# EAGLE design BarGraphDriver (EAGLE 7.5.0)
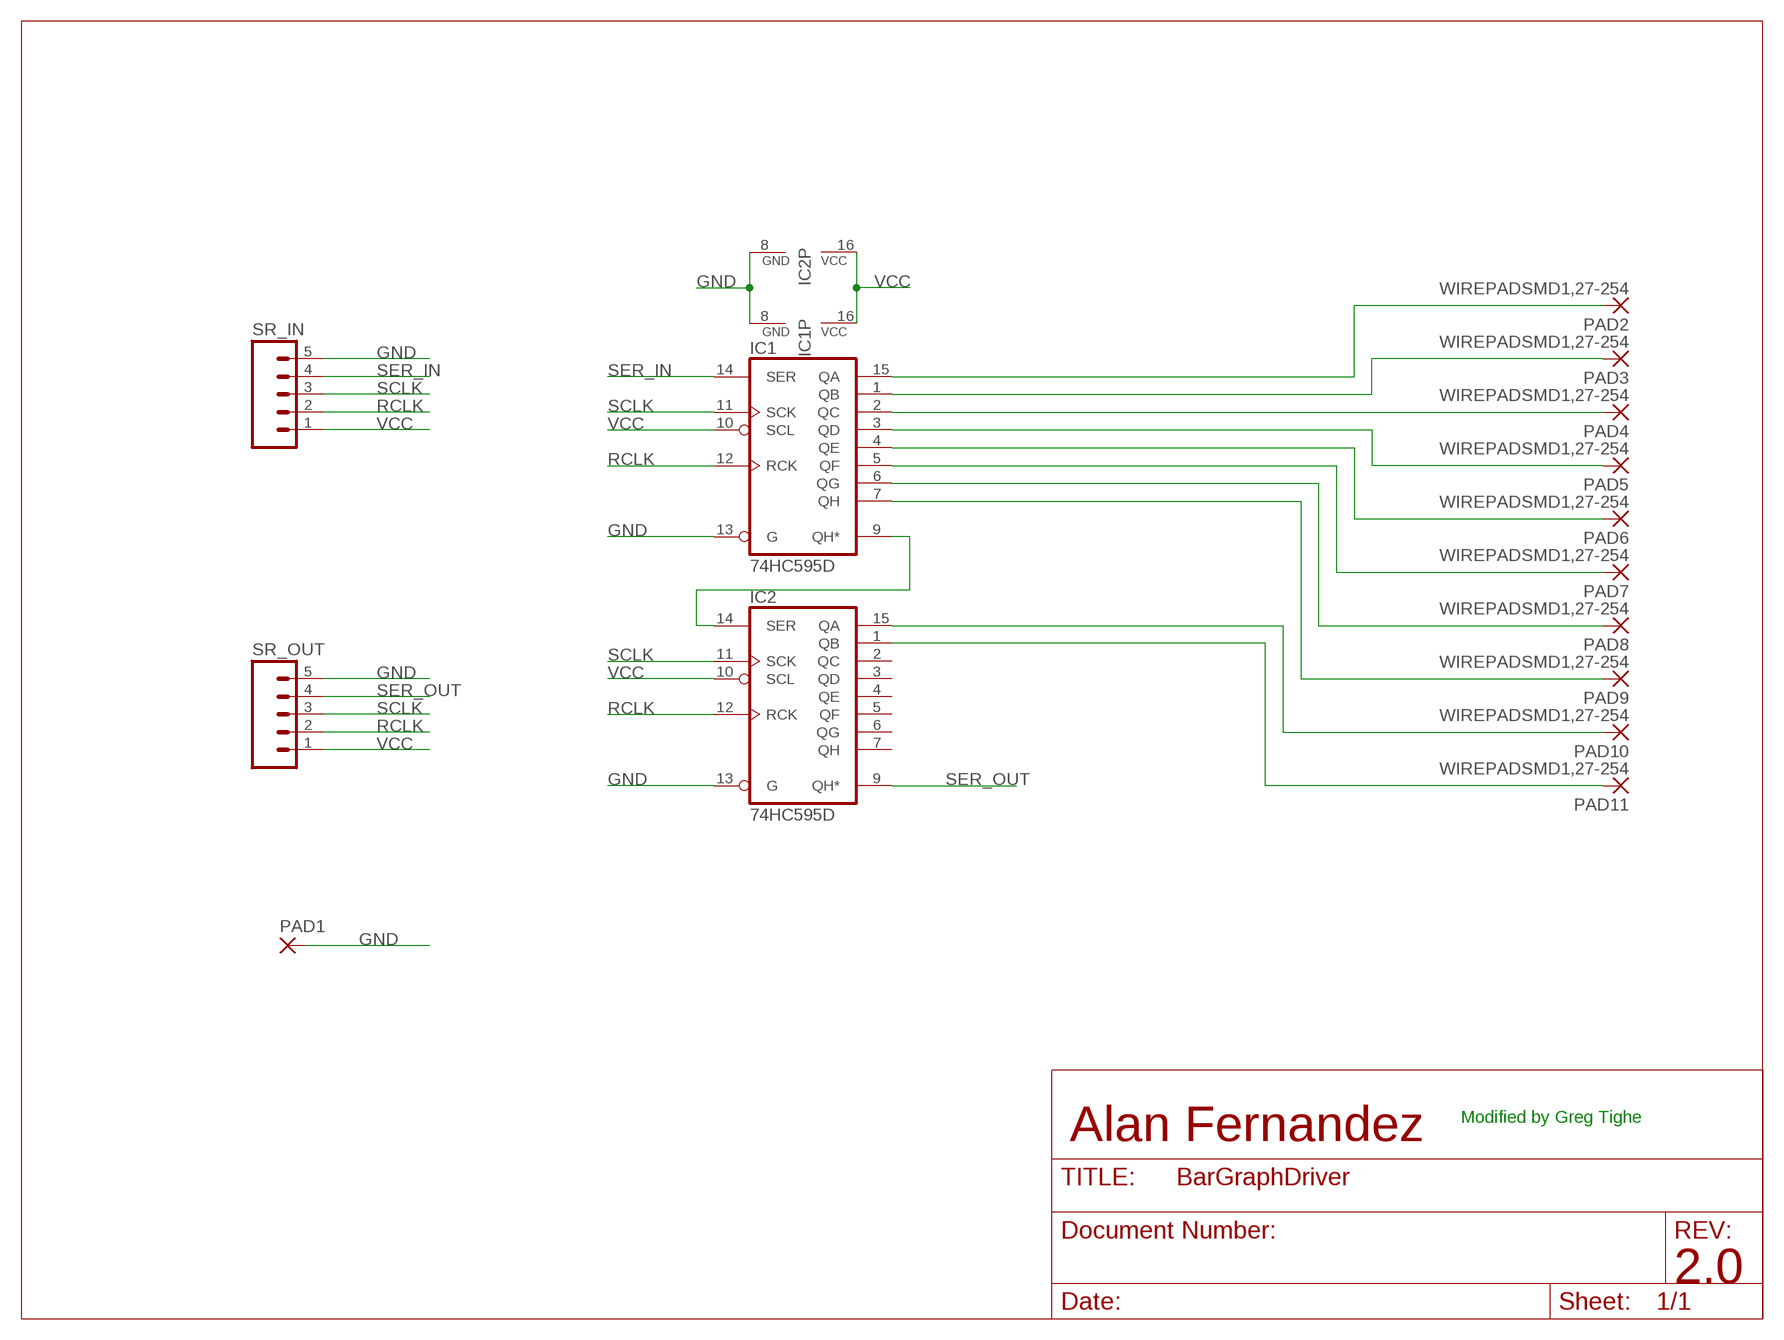
[diagram p0: schematic, sheet 1]

## Parts
IC1  74HC595D  [SO16]
IC2  74HC595D  [SO16]
PAD1  SMD2  [SMD1,27-2,54]
PAD2  WIREPADSMD1,27-254  [SMD1,27-2,54]
PAD3  WIREPADSMD1,27-254  [SMD1,27-2,54]
PAD4  WIREPADSMD1,27-254  [SMD1,27-2,54]
PAD5  WIREPADSMD1,27-254  [SMD1,27-2,54]
PAD6  WIREPADSMD1,27-254  [SMD1,27-2,54]
PAD7  WIREPADSMD1,27-254  [SMD1,27-2,54]
PAD8  WIREPADSMD1,27-254  [SMD1,27-2,54]
PAD9  WIREPADSMD1,27-254  [SMD1,27-2,54]
PAD10  WIREPADSMD1,27-254  [SMD1,27-2,54]
PAD11  WIREPADSMD1,27-254  [SMD1,27-2,54]
SR_IN  M05PTH  [1X05]
SR_OUT  M05PTH  [1X05]

## Nets
GND [GND]: IC1.8(GND) IC1.13(G) IC2.8(GND) IC2.13(G) PAD1.1(P) SR_IN.5 SR_OUT.5
N$1 [LED]: IC2.1(QB) PAD11.1(P)
N$11 [LED]: IC1.15(QA) PAD2.1(P)
N$12 [LED]: IC1.1(QB) PAD3.1(P)
N$13 [LED]: IC1.2(QC) PAD4.1(P)
N$14 [LED]: IC1.3(QD) PAD5.1(P)
N$15 [LED]: IC1.4(QE) PAD6.1(P)
N$16 [LED]: IC1.5(QF) PAD7.1(P)
N$17 [LED]: IC1.6(QG) PAD8.1(P)
N$18 [LED]: IC1.7(QH) PAD9.1(P)
N$19 [LED]: IC2.15(QA) PAD10.1(P)
N$22: IC1.9(QH*) IC2.14(SER)
RCLK: IC1.12(RCK) IC2.12(RCK) SR_IN.2 SR_OUT.2
SCLK: IC1.11(SCK) IC2.11(SCK) SR_IN.3 SR_OUT.3
SER_IN: IC1.14(SER) SR_IN.4
SER_OUT: IC2.9(QH*) SR_OUT.4
VCC [VCC]: IC1.10(SCL) IC1.16(VCC) IC2.10(SCL) IC2.16(VCC) SR_IN.1 SR_OUT.1
Unconnected: IC2.2(QC) IC2.3(QD) IC2.4(QE) IC2.5(QF) IC2.6(QG) IC2.7(QH)

## Notes on the sheet
- Modified by Greg Tighe
- Alan Fernandez
- 2.0

## Library data of the parts
IC1 IC2 = 74xx-eu:74*595: 8-bit SHIFT REGISTER, output latch
PAD1 = wirepad:SMD2: SMD PAD
PAD2-PAD11 = wirepad:WIREPAD: Wire PAD connect wire on PCB
SR_IN SR_OUT = SparkFun-Connectors:M05: Header 5 Standard 5-pin 0.1" header. Use with straight break away headers (SKU : PRT-00116), right angle break away headers (PRT-00553), swiss pins (PRT-00743), machine pins (PRT-00117), and female headers (PRT-00115). Molex polarized connector foot print use with SKU : PRT-08230 with associated crimp pins and housings.

## Net classes
0 default: width 0.406 mm, drill 0.381 mm, clearance 0.305 mm
1 VCC: width 0.406 mm, drill 0.381 mm, clearance 0.305 mm
2 LED: width 0.406 mm, drill 0.381 mm, clearance 0.305 mm
3 GND: width 0.406 mm, drill 0.381 mm, clearance 0.305 mm

## Board
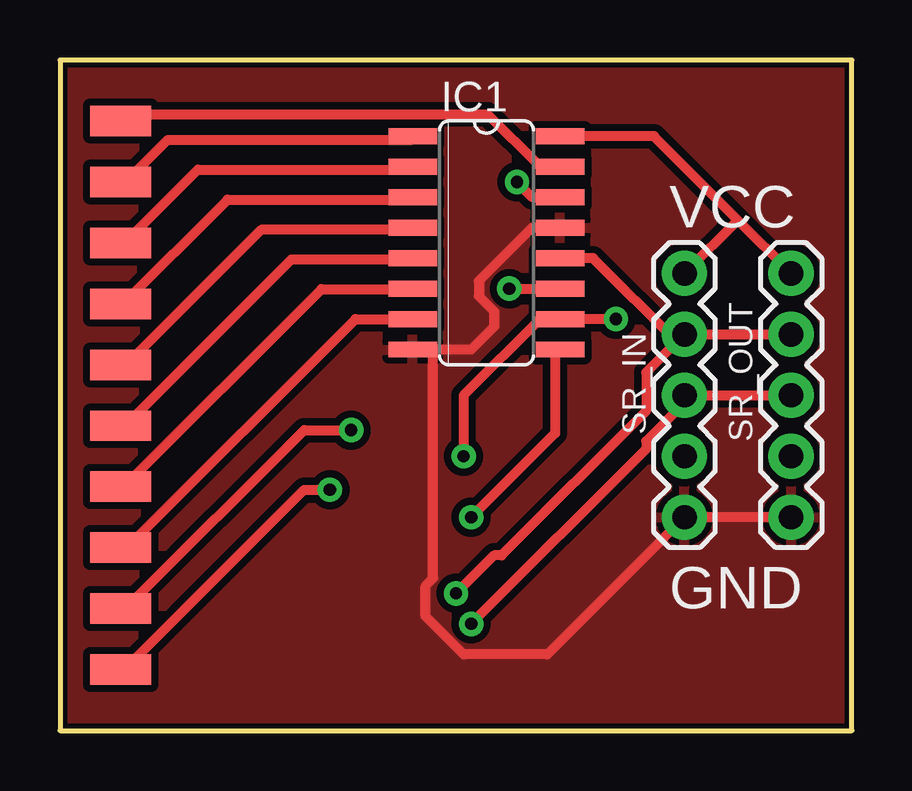
[diagram p1: board, top side]
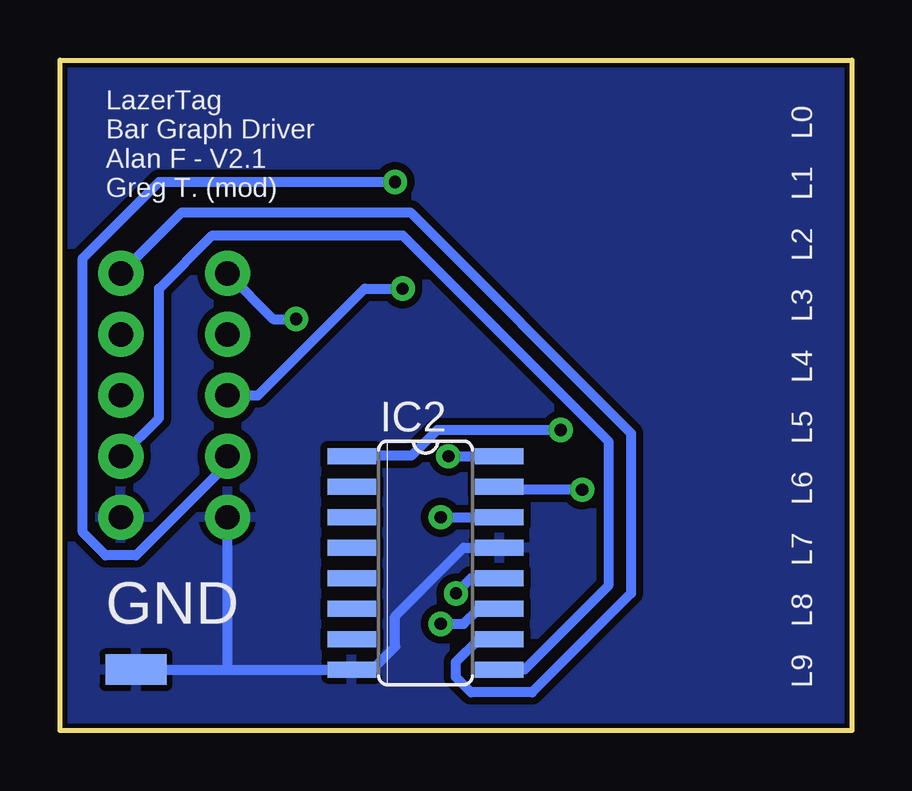
[diagram p2: board, bottom side, seen from below]

Size 33.02 x 27.94 mm. Coordinates in mm from the lower left corner, seen from the top.
Outline: 0,27.94 0,0 33.02,0 33.02,27.94 0,27.94
Copper layers (1*16): Top 0.035mm / dielectric 1.5mm / Bottom 0.035mm
Design rules "SparkFun-2-layer-STANDARD": minimum track width 10mil, minimum drill 20mil, track to track 10mil, track to pad 8mil, pad to pad 8mil, via to via 10mil, smd to smd 8mil, copper to edge 8mil, drill to drill 8mil, minimum pad ring 10mil, minimum via ring 10mil, stop-mask expansion 4mil, vias tented up to drill 25mil, thermal gap 10mil

### Footprints (pad centres in the part's own frame; a part is rotated, then mirrored left to right if it is on the bottom)
SO16 = smd 0.66 x 2.032: 1 -4.445,-3.073; 2 -3.175,-3.073; 3 -1.905,-3.073; 4 -0.635,-3.073; 5 0.635,-3.073; 6 1.905,-3.073; 7 3.175,-3.073; 8 4.445,-3.073; 9 4.445,3.073; 10 3.175,3.073; 11 1.905,3.073; 12 0.635,3.073; 13 -0.635,3.073; 14 -1.905,3.073; 15 -3.175,3.073; 16 -4.445,3.073
SMD1,27-2,54 = smd 1.27 x 2.54: 1 0,0
1X05 = drill 1.016 pad 1.88: 1 0,0; 2 2.54,0; 3 5.08,0; 4 7.62,0; 5 10.16,0

### Placement (x,y rotation side)
IC1  17.78,20.32 270 top
IC2  17.78,6.98 270 bottom
PAD1  29.84,2.54 90 bottom
PAD2  2.54,25.4 90 top
PAD3  2.54,22.86 90 top
PAD4  2.54,20.32 90 top
PAD5  2.54,17.78 90 top
PAD6  2.54,15.24 90 top
PAD7  2.54,12.7 90 top
PAD8  2.54,10.16 90 top
PAD9  2.54,7.62 90 top
PAD10  2.54,2.54 90 top
PAD11  2.54,5.08 90 top
SR_IN  26.03,19.05 270 top
SR_OUT  30.48,19.05 270 top

### Tracks (layer width: path | path; a pad name or v marks a point on that pad's centre or on a via)
GND
  Top 0.406: 15.56,15.88 17.14,15.88 18.1,16.83 18.1,17.46 17.46,18.1 17.46,18.73 19.68,20.95 IC1.13 | SR_OUT.5 SR_IN.5 20.32,3.18 16.83,3.18 15.24,4.76 15.24,6.03 15.56,6.35 15.56,15.88 | 15.56,15.88 IC1.8
  Bottom 0.406: PAD1.1 26.03,2.54 | 26.03,2.54 IC2.8 20,2.54 19.05,3.49 19.05,4.76 16.19,7.62 IC2.13 | 26.03,2.54 SR_IN.5
  pour Bottom: 0,27.94 33.02,27.94 33.02,0 0,0
  pour Top: 0,27.94 33.02,27.94 33.02,0 0,0
N$1  (via drill 0.51)
  Top 0.406: v12.14,12.52 10.19,12.52 2.9,5.23 2.54,5.23 PAD11.1
  Bottom 0.406: v12.14,12.52 17.3,12.52 18.36,11.45 20.85,11.45 IC2.1
N$11
  Top 0.406: IC1.15 20.85,23.55 19.96,23.55 17.83,25.68 2.72,25.68 2.54,25.5 PAD2.1
N$12
  Top 0.406: IC1.1 14.63,24.61 4.5,24.61 2.9,23.01 2.54,23.01 PAD3.1
N$13
  Top 0.406: IC1.2 14.63,23.37 5.74,23.37 2.54,20.17 PAD4.1
N$14
  Top 0.406: IC1.3 14.63,22.12 6.99,22.12 2.54,17.68 PAD5.1
N$15
  Top 0.406: IC1.4 14.63,20.88 8.41,20.88 2.9,15.37 2.54,15.37 PAD6.1
N$16
  Top 0.406: PAD7.1 2.72,12.7 9.65,19.63 14.63,19.63 IC1.5
N$17
  Top 0.406: IC1.6 14.63,18.39 10.9,18.39 2.54,10.03 PAD8.1
N$18
  Top 0.406: IC1.7 12.32,17.15 2.9,7.72 2.54,7.72 PAD9.1
N$19  (via drill 0.51)
  Top 0.406: v11.25,10.03 10.19,10.03 2.54,2.39 PAD10.1
  Bottom 0.406: v11.25,10.03 14.63,10.03 IC2.15
N$22  (via drill 0.51)
  Top 0.406: v17.14,8.89 20.64,12.38 20.64,15.88 IC1.9
  Bottom 0.406: v17.14,8.89 IC2.14
RCLK  (via drill 0.51)
  Top 0.406: v16.51,5.71 18.1,7.3 18.41,7.3 24.45,13.34 24.45,14.92 25.72,16.19 | IC1.12 22.23,19.69 25.72,16.19 | 25.72,16.19 SR_IN.2 SR_OUT.2
  Bottom 0.406: IC2.12 15.87,6.35 v16.51,5.71
SCLK  (via drill 0.51)
  Top 0.406: v17.14,4.45 24.45,11.75 24.45,12.06 26.03,13.65 SR_IN.3 SR_OUT.3 | v18.73,18.41 IC1.11
  Bottom 0.406: IC2.11 15.56,5.08 16.19,4.45 v17.14,4.45 | v18.73,18.41 20.32,18.41 24.77,13.97 SR_IN.3
SER_IN  (via drill 0.51)
  Top 0.406: IC1.14 19.68,22.23 v19.05,22.86
  Bottom 0.406: v19.05,22.86 28.89,22.86 32.07,19.69 32.07,8.25 31.11,7.3 29.84,7.3 26.03,11.11 SR_IN.4
SER_OUT
  Bottom 0.406: IC2.9 13.65,2.54 10.16,6.03 10.16,12.06 18.73,20.64 26.67,20.64 28.89,18.41 28.89,13.02 SR_OUT.4
VCC  (via drill 0.51)
  Top 0.406: v16.83,11.43 16.83,13.97 20,17.15 IC1.10 v23.18,17.15 | IC1.16 24.77,24.77 28.26,21.27 | SR_OUT.1 28.26,21.27 | 28.26,21.27 SR_IN.1
  Bottom 0.406: v16.83,11.43 IC2.16 | IC2.10 15.56,3.81 16.51,2.86 16.51,2.22 15.87,1.59 13.33,1.59 9.21,5.71 9.21,12.38 18.41,21.59 27.94,21.59 SR_OUT.1 | v23.18,17.15 24.13,17.15 SR_IN.1

### Text on the board
bPlace: L0 | L1 | LazerTag / Bar Graph Driver / Alan F - V2.1 / Greg T. (mod) | L2 | L3 | L4 | L5 | L6 | L7 | L8 | L9
tNames: VCC | GND
bNames: GND